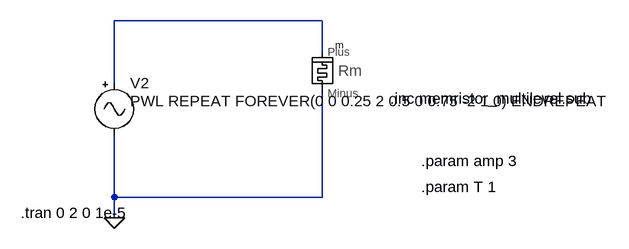
[diagram p0: schematic memristor_scheme.asc]
memristor_scheme.asc, the LTspice schematic file:
Version 4
SHEET 1 1656 680
WIRE 320 -48 0 -48
WIRE 320 0 320 -48
WIRE 0 48 0 -48
WIRE 0 224 0 128
WIRE 320 224 320 64
WIRE 320 224 0 224
WIRE 0 256 0 224
FLAG 0 256 0
SYMBOL memristor 336 64 R0
SYMATTR InstName m
SYMBOL Misc\\signal 0 32 R0
WINDOW 3 24 44 Left 2
WINDOW 123 0 0 Left 2
WINDOW 39 0 0 Left 2
SYMATTR InstName V2
SYMATTR Value PWL REPEAT FOREVER(0 0 0.25 2 0.5 0 0.75 -2 1 0) ENDREPEAT
TEXT -144 248 Left 2 !.tran 0 2 0 1e-5
TEXT 472 208 Left 2 !.param T 1
TEXT 472 168 Left 2 !.param amp 3
TEXT 424 72 Left 2 !.inc memristor_multilevel.sub

The netlist it stands for:
* memristor_scheme.asc
Xm N001 0 memristor  ; pins Plus Minus
V2 N001 0 PWL REPEAT FOREVER(0 0 0.25 2 0.5 0 0.75 -2 1 0) ENDREPEAT
.tran 0 2 0 1e-5
.param T 1
.param amp 3
.inc memristor_multilevel.sub
.backanno
.end